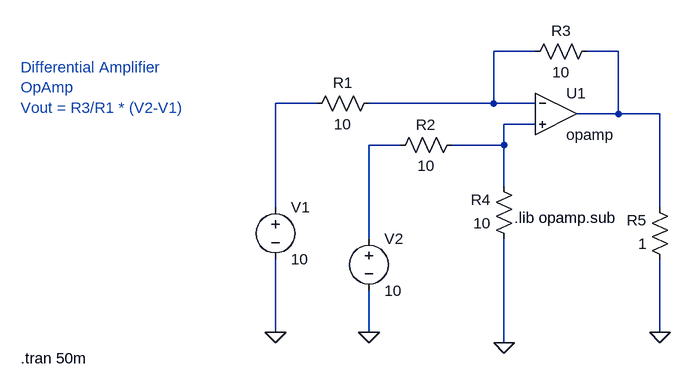
[diagram p0: schematic DifferentailAmplifier.asc]
DifferentailAmplifier.asc, the LTspice schematic file:
Version 4.1
SHEET 1 880 680
WIRE 464 -128 400 -128
WIRE 592 -128 544 -128
WIRE 128 -48 64 -48
WIRE 400 -48 400 -128
WIRE 400 -48 208 -48
WIRE 464 -48 400 -48
WIRE 592 -32 592 -128
WIRE 592 -32 528 -32
WIRE 656 -32 592 -32
WIRE 464 -16 416 -16
WIRE 256 16 208 16
WIRE 416 16 416 -16
WIRE 416 16 336 16
WIRE 416 80 416 16
WIRE 64 112 64 -48
WIRE 656 112 656 -32
WIRE 208 160 208 16
WIRE 64 304 64 192
WIRE 208 304 208 240
WIRE 656 304 656 192
WIRE 416 320 416 160
FLAG 64 304 0
FLAG 208 304 0
FLAG 416 320 0
FLAG 656 304 0
SYMBOL voltage 64 96 R0
WINDOW 123 0 0 Left 0
WINDOW 39 0 0 Left 0
SYMATTR InstName V1
SYMATTR Value 10
SYMBOL voltage 208 144 R0
WINDOW 123 0 0 Left 0
WINDOW 39 0 0 Left 0
SYMATTR InstName V2
SYMATTR Value 10
SYMBOL res 224 -64 R90
WINDOW 0 0 56 VBottom 2
WINDOW 3 32 56 VTop 2
SYMATTR InstName R1
SYMATTR Value 10
SYMBOL res 352 0 R90
WINDOW 0 0 56 VBottom 2
WINDOW 3 32 56 VTop 2
SYMATTR InstName R2
SYMATTR Value 10
SYMBOL res 560 -144 R90
WINDOW 0 0 56 VBottom 2
WINDOW 3 32 56 VTop 2
SYMATTR InstName R3
SYMATTR Value 10
SYMBOL res 432 176 R180
WINDOW 0 36 76 Left 2
WINDOW 3 36 40 Left 2
SYMATTR InstName R4
SYMATTR Value 10
SYMBOL res 672 208 R180
WINDOW 0 36 76 Left 2
WINDOW 3 36 40 Left 2
SYMATTR InstName R5
SYMATTR Value 1
SYMBOL OpAmps\\opamp 496 -96 R0
SYMATTR InstName U1
TEXT -328 -104 Left 2 ;Differential Amplifier \nOpAmp\nVout = R3/R1 * (V2-V1)
TEXT 432 128 Left 2 !.lib opamp.sub
TEXT -328 344 Left 2 !.tran 50m

The netlist it stands for:
* DifferentailAmplifier.asc
V1 N003 0 10
V2 N005 0 10
R1 N001 N003 10
R2 N004 N005 10
R3 N002 N001 10
R4 0 N004 10
R5 0 N002 1
X§U1 N001 N004 N002 opamp Aol=100K GBW=10Meg  ; pins invin noninvin out
* Differential Amplifier
* OpAmp
* Vout = R3/R1 * (V2-V1)
.lib opamp.sub
.tran 50m
.backanno
.end